# Altium schematic sheet XS1_XCORE1.SchDoc: XS1 XCORE1
size A3; Date: 2011-11-28; Author: S.Choquette; Revision: 2.0; SheetNumber: 4; SheetTotal: 9
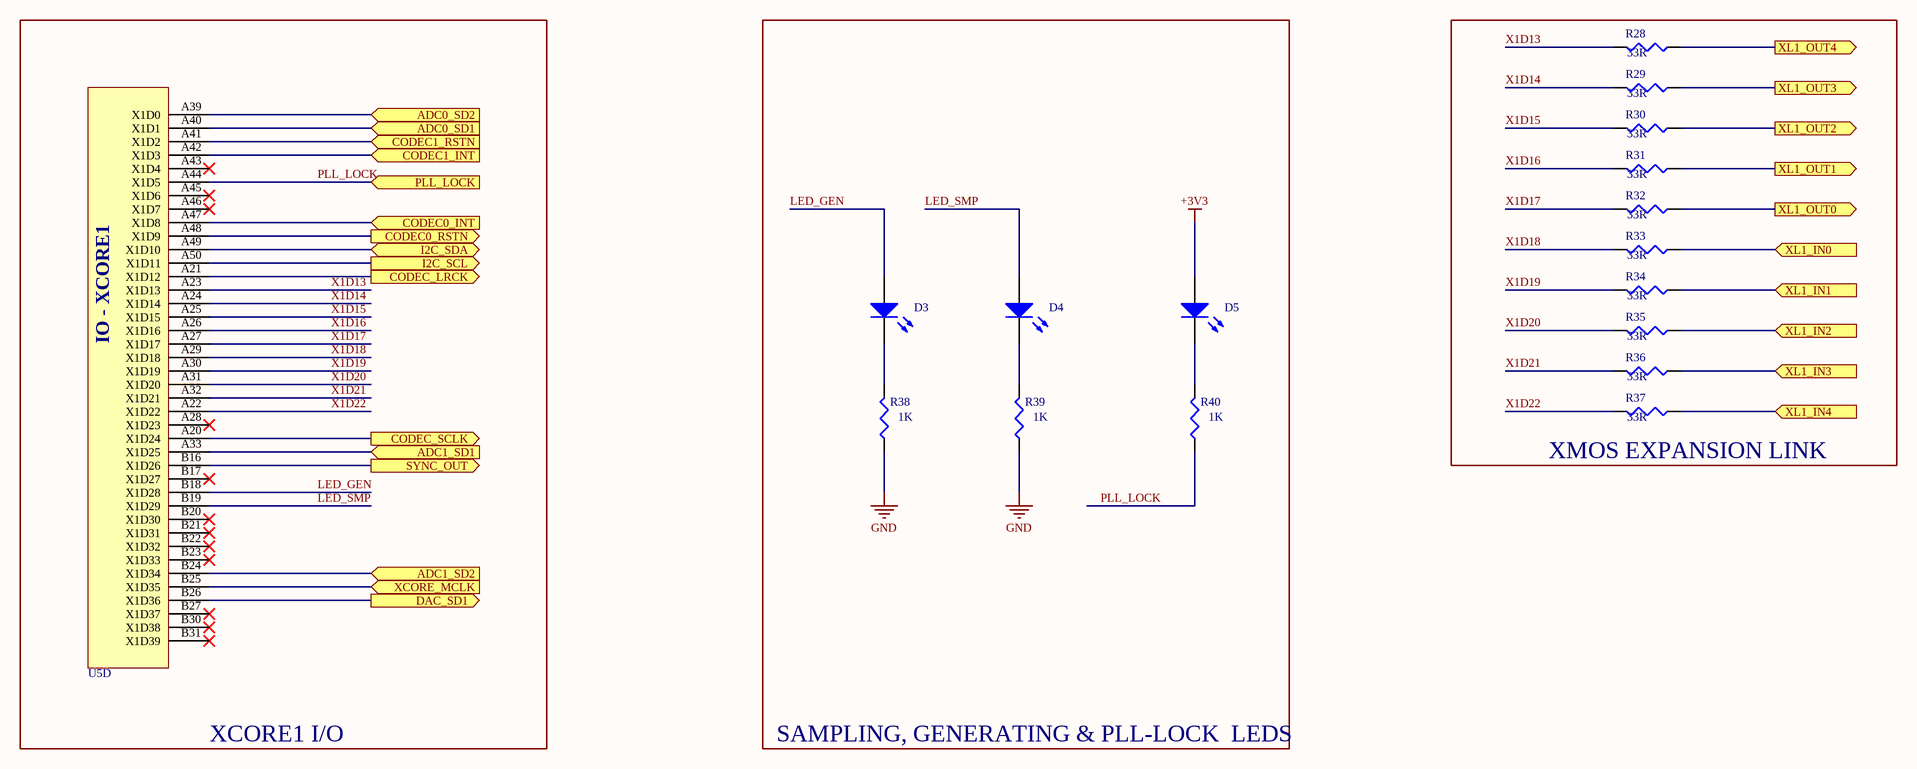
[diagram p0: XS1_XCORE1.SchDoc]

## Parts
D3  GEN  [LED_0603]  (value not drawn)
D4  SMP  [LED_0603]  (value not drawn)
D5  PLL  [LED_0603]  (value not drawn)
R28  value 33R  [3-0603]
R29  value 33R  [3-0603]
R30  value 33R  [3-0603]
R31  value 33R  [3-0603]
R32  value 33R  [3-0603]
R33  value 33R  [3-0603]
R34  value 33R  [3-0603]
R35  value 33R  [3-0603]
R36  value 33R  [3-0603]
R37  value 33R  [3-0603]
R38  value 1K  [3-0603]
R39  value 1K  [3-0603]
R40  value 1K  [3-0603]
U5  XS1_L2_124QFN  [QFN-124]  (value not drawn)  (part D of 4)

## Blocks framed on the sheet
XCORE1 I/O: U5
SAMPLING, GENERATING & PLL-LOCK  LEDS: D3-D5 R38-R40
XMOS EXPANSION LINK: R28-R37

## Ports
ADC0_SD1 (in), ADC0_SD2 (in), ADC1_SD1 (in), ADC1_SD2 (in), CODEC0_INT (in), CODEC0_RSTN (out), CODEC1_INT (in), CODEC1_RSTN (in), CODEC_LRCK (out), CODEC_SCLK (out), DAC_SD1 (out), I2C_SCL (out), I2C_SDA (bidir), PLL_LOCK (in), SYNC_OUT (out), XCORE_MCLK (in), XL1_IN0 (in), XL1_IN1 (in), XL1_IN2 (in), XL1_IN3 (in), XL1_IN4 (in), XL1_OUT0 (out), XL1_OUT1 (out), XL1_OUT2 (out), XL1_OUT3 (out), XL1_OUT4 (out)

## Nets
+3V3: D5.1(A)
GND: R38.1 R39.1
ADC0_SD1: U5.A40(X1D1) ; port ADC0_SD1
ADC0_SD2: U5.A39(X1D0) ; port ADC0_SD2
ADC1_SD1: U5.A33(X1D25) ; port ADC1_SD1
ADC1_SD2: U5.B24(X1D34) ; port ADC1_SD2
CODEC0_INT: U5.A47(X1D8) ; port CODEC0_INT
CODEC0_RSTN: U5.A48(X1D9) ; port CODEC0_RSTN
CODEC1_INT: U5.A42(X1D3) ; port CODEC1_INT
CODEC1_RSTN: U5.A41(X1D2) ; port CODEC1_RSTN
CODEC_LRCK: U5.A21(X1D12) ; port CODEC_LRCK
CODEC_SCLK: U5.A20(X1D24) ; port CODEC_SCLK
DAC_SD1: U5.B26(X1D36) ; port DAC_SD1
I2C_SCL: U5.A50(X1D11) ; port I2C_SCL
I2C_SDA: U5.A49(X1D10) ; port I2C_SDA
LED_GEN: D3.1(A) U5.B18(X1D28)
LED_SMP: D4.1(A) U5.B19(X1D29)
PLL_LOCK: R40.1 U5.A44(X1D5) ; port PLL_LOCK
SYNC_OUT: U5.B16(X1D26) ; port SYNC_OUT
X1D13: R28.2 U5.A23(X1D13)
X1D14: R29.2 U5.A24(X1D14)
X1D15: R30.2 U5.A25(X1D15)
X1D16: R31.2 U5.A26(X1D16)
X1D17: R32.2 U5.A27(X1D17)
X1D18: R33.2 U5.A29(X1D18)
X1D19: R34.2 U5.A30(X1D19)
X1D20: R35.2 U5.A31(X1D20)
X1D21: R36.2 U5.A32(X1D21)
X1D22: R37.2 U5.A22(X1D22)
XCORE_MCLK: U5.B25(X1D35) ; port XCORE_MCLK
XL1_IN0: R33.1 ; port XL1_IN0
XL1_IN1: R34.1 ; port XL1_IN1
XL1_IN2: R35.1 ; port XL1_IN2
XL1_IN3: R36.1 ; port XL1_IN3
XL1_IN4: R37.1 ; port XL1_IN4
XL1_OUT0: R32.1 ; port XL1_OUT0
XL1_OUT1: R31.1 ; port XL1_OUT1
XL1_OUT2: R30.1 ; port XL1_OUT2
XL1_OUT3: R29.1 ; port XL1_OUT3
XL1_OUT4: R28.1 ; port XL1_OUT4
NetD3_2: D3.2(K) R38.2
NetD4_2: D4.2(K) R39.2
NetD5_2: D5.2(K) R40.2

Not connected (* = marked no-connect by the designer): U5 A28(X1D23)* A43(X1D4)* A45(X1D6)* A46(X1D7)* B17(X1D27)* B20(X1D30)* B21(X1D31)* B22(X1D32)* B23(X1D33)* B27(X1D37)* B30(X1D38)* B31(X1D39)*

## Notes on the sheet
- Title:
- Date:
- Sheet:
- of
- Author:
- Team members:
- M.Bandou, A.Béland, G.Cayer,
- Rev.:
- Released under Creative Common Licence Attribution-ShareAlike 2.5 Canada (CC BY-SA 2.5)
- S.Choquette, F.Gosselin,
- F.Robitaillle, D.Telly.Kizito
- Info.: http://sourceforge.net/projects/eightsoundsusb/
- Design inspired by XMOS USB Audio 2.0  Mutlichannel Ref.
- (in symbol XS1_L2_124QFN, part D) IO - XCORE1

## Library data of the parts
D3-D5 = LED2: LED, GREEN, 0603; Manufacturer: Kingbright; Part Number: APT1608CGCK; Publisher: Altium Limited
R28-R37 = Res3: RES 33R 0603 1%; Manufacturer: ROHM; Part Number: MCR03EZPFX33R0; Cost: *
R38-R40 = Res3: RES 1k 0603 1%; Manufacturer: ROHM; Part Number: MCR03EZPFX1001; Cost: *
U5 = XS1_L2_124QFN: Manufacturer: XMOS; Part Number: XS1-L02A-QF124-C4; Cost: *